# EAGLE design Smart_Mic_V01 (EAGLE 9.2.2)

## Sheet 1 of 2
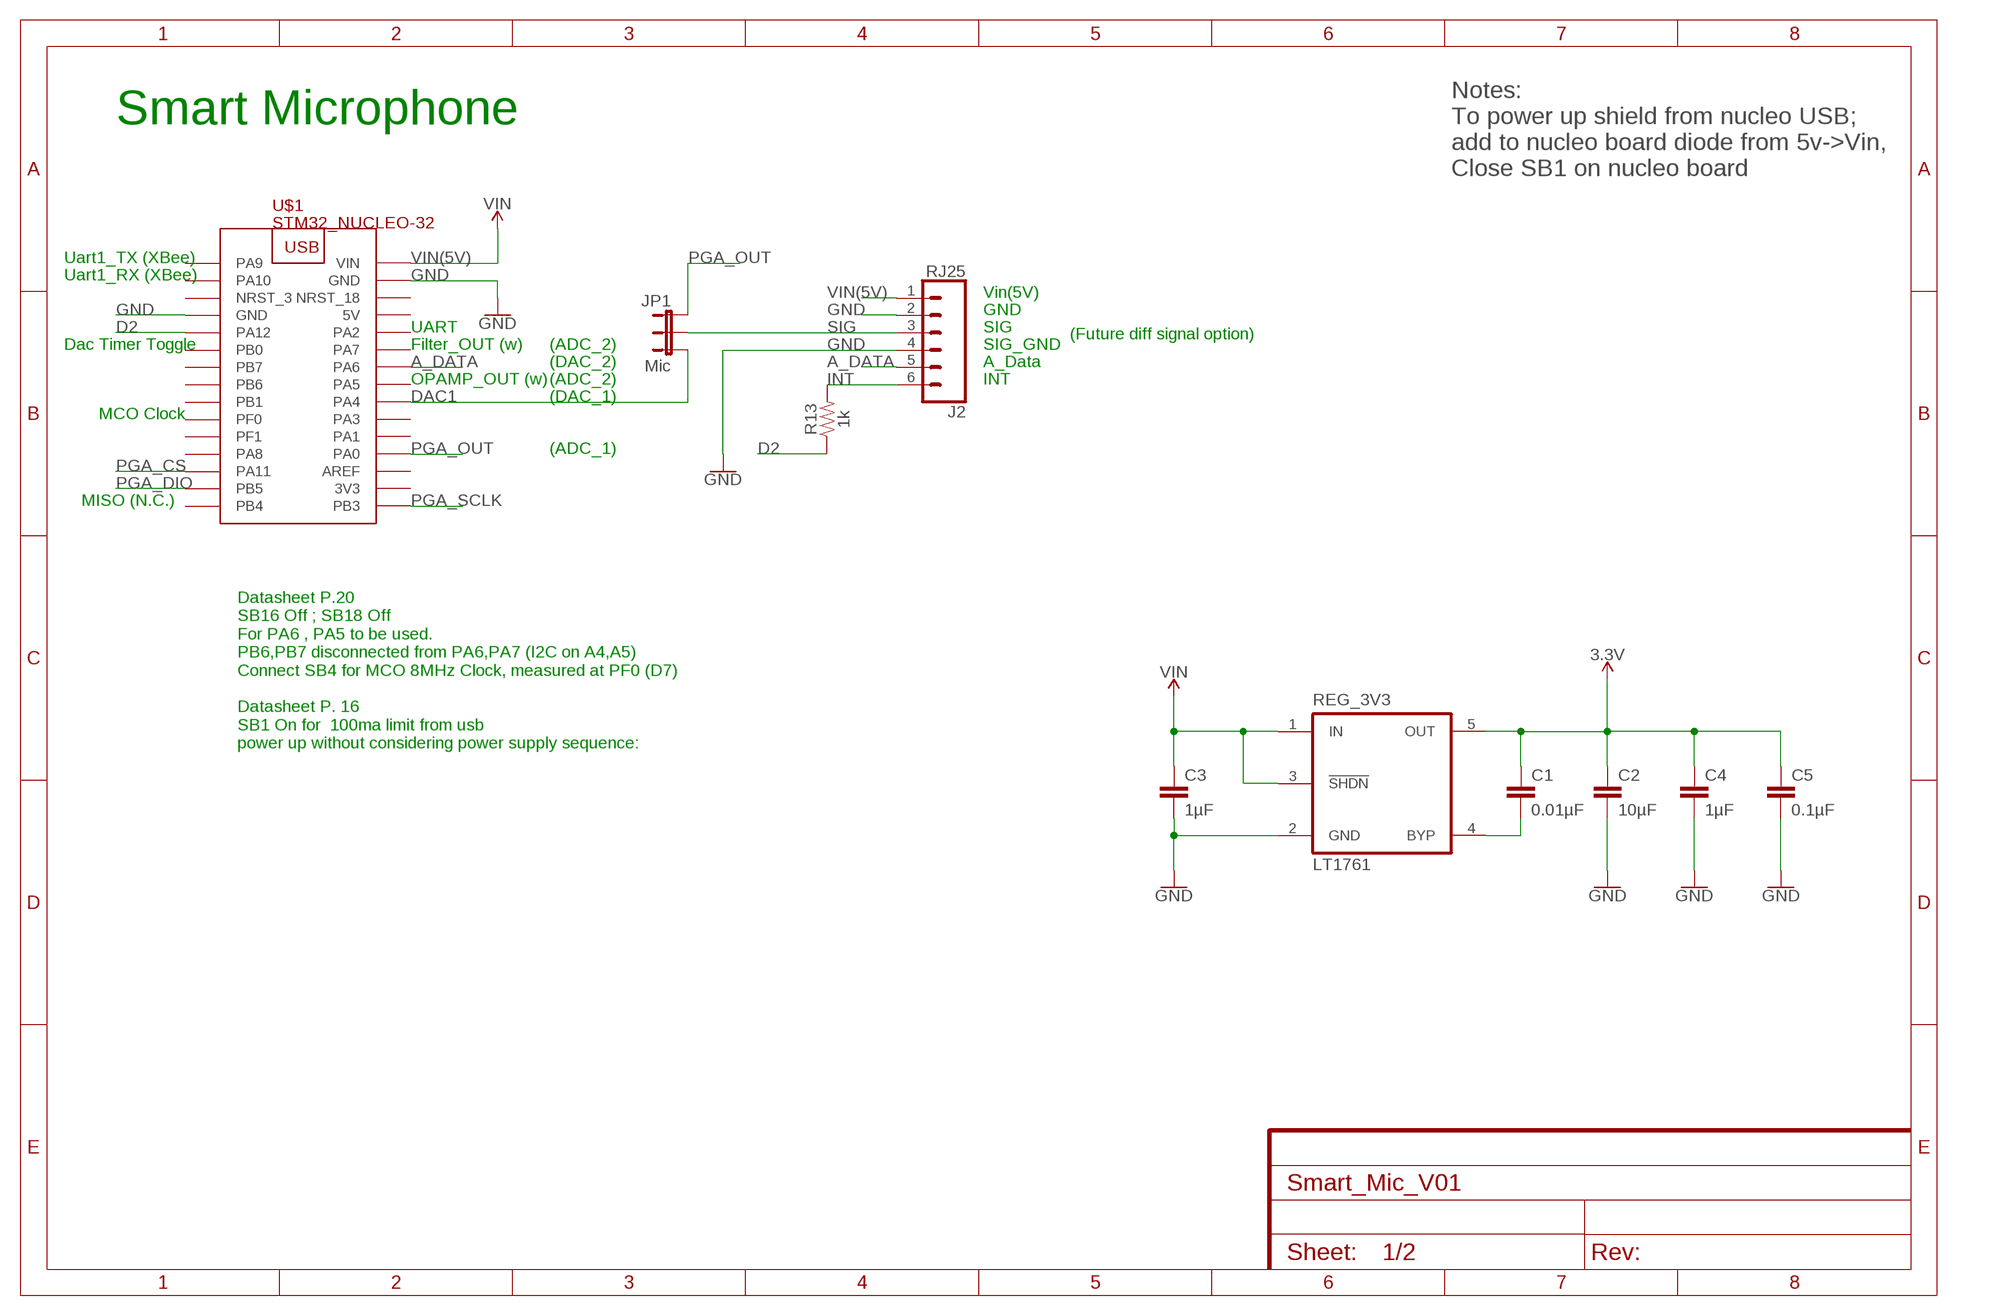
[diagram p0: schematic, sheet 1]

### Parts
C1  0.01µF  0.33UF/330NF-0805-50V-10%  [0805]
C2  10µF  0.33UF/330NF-0805-50V-10%  [0805]
C3  1µF  0.33UF/330NF-0805-50V-10%  [0805]
C4  1µF  0.33UF/330NF-0805-50V-10%  [0805]
C5  0.1µF  0.33UF/330NF-0805-50V-10%  [0805]
J2  RJ25  RJ11-6  [RJ11-6]
JP1  Mic  JUMPER-3PTH  [1X03]
R13  1k  RESISTOR0805  [0805]
REG_3V3  LT1761  [SOT23-5]
U$1  STM32_NUCLEO-32  [STM32_NUCLEO-32]

### Nets
3.3V: C1.1 C2.1 C4.1 C5.1 REG_3V3.5(OUT) ; also sheet 2
A_DATA: J2.5 U$1.PA6
BYP: C1.2 REG_3V3.4(BYP)
D2: R13.1 U$1.PA12
DAC1: JP1.3 U$1.PA4
GND: C2.2 C3.2 C4.2 C5.2 J2.2 J2.4 REG_3V3.2(GND) U$1.GND@4(GND) U$1.GND@17(GND) ; also sheet 2
INT: J2.6 R13.2
PGA_CS: U$1.PA11 ; also sheet 2
PGA_DIO: U$1.PB5 ; also sheet 2
PGA_OUT: JP1.1 U$1.PA0 ; also sheet 2
PGA_SCLK: U$1.PB3 ; also sheet 2
SIG: J2.3 JP1.2
VIN(5V): C3.1 J2.1 REG_3V3.1(IN) REG_3V3.3(!SHDN!) U$1.VIN ; supply symbol labelled VIN
Unconnected: U$1.AREF U$1.NRST_3 U$1.NRST_18 U$1.PA1 U$1.PA2 U$1.PA3 U$1.PA5 U$1.PA7 U$1.PA8 U$1.PA9 U$1.PA10 U$1.PB0 U$1.PB1 U$1.PB4 U$1.PB6 U$1.PB7 U$1.PF0 U$1.PF1

### Notes on the sheet
- Smart Microphone
- Notes:
  To power up shield from nucleo USB; 
  add to nucleo board diode from 5v->Vin,
  Close SB1 on nucleo board
- Uart1_TX (XBee)
- Uart1_RX (XBee)
- Vin(5V)
- GND
- UART | SIG
- (Future diff signal option)
- Dac Timer Toggle | Filter_OUT (w) | (ADC_2) | SIG_GND
- (DAC_2) | A_Data
- OPAMP_OUT (w) | (ADC_2) | INT
- (DAC_1)
- MCO Clock
- (ADC_1)
- MISO (N.C.)
- Datasheet P.20
  SB16 Off ; SB18 Off
  For PA6 , PA5 to be used.
  PB6,PB7 disconnected from PA6,PA7 (I2C on A4,A5)
  Connect SB4 for MCO 8MHz Clock, measured at PF0 (D7)
  
  Datasheet P. 16
  SB1 On for  100ma limit from usb 
  power up without considering power supply sequence:

## Sheet 2 of 2
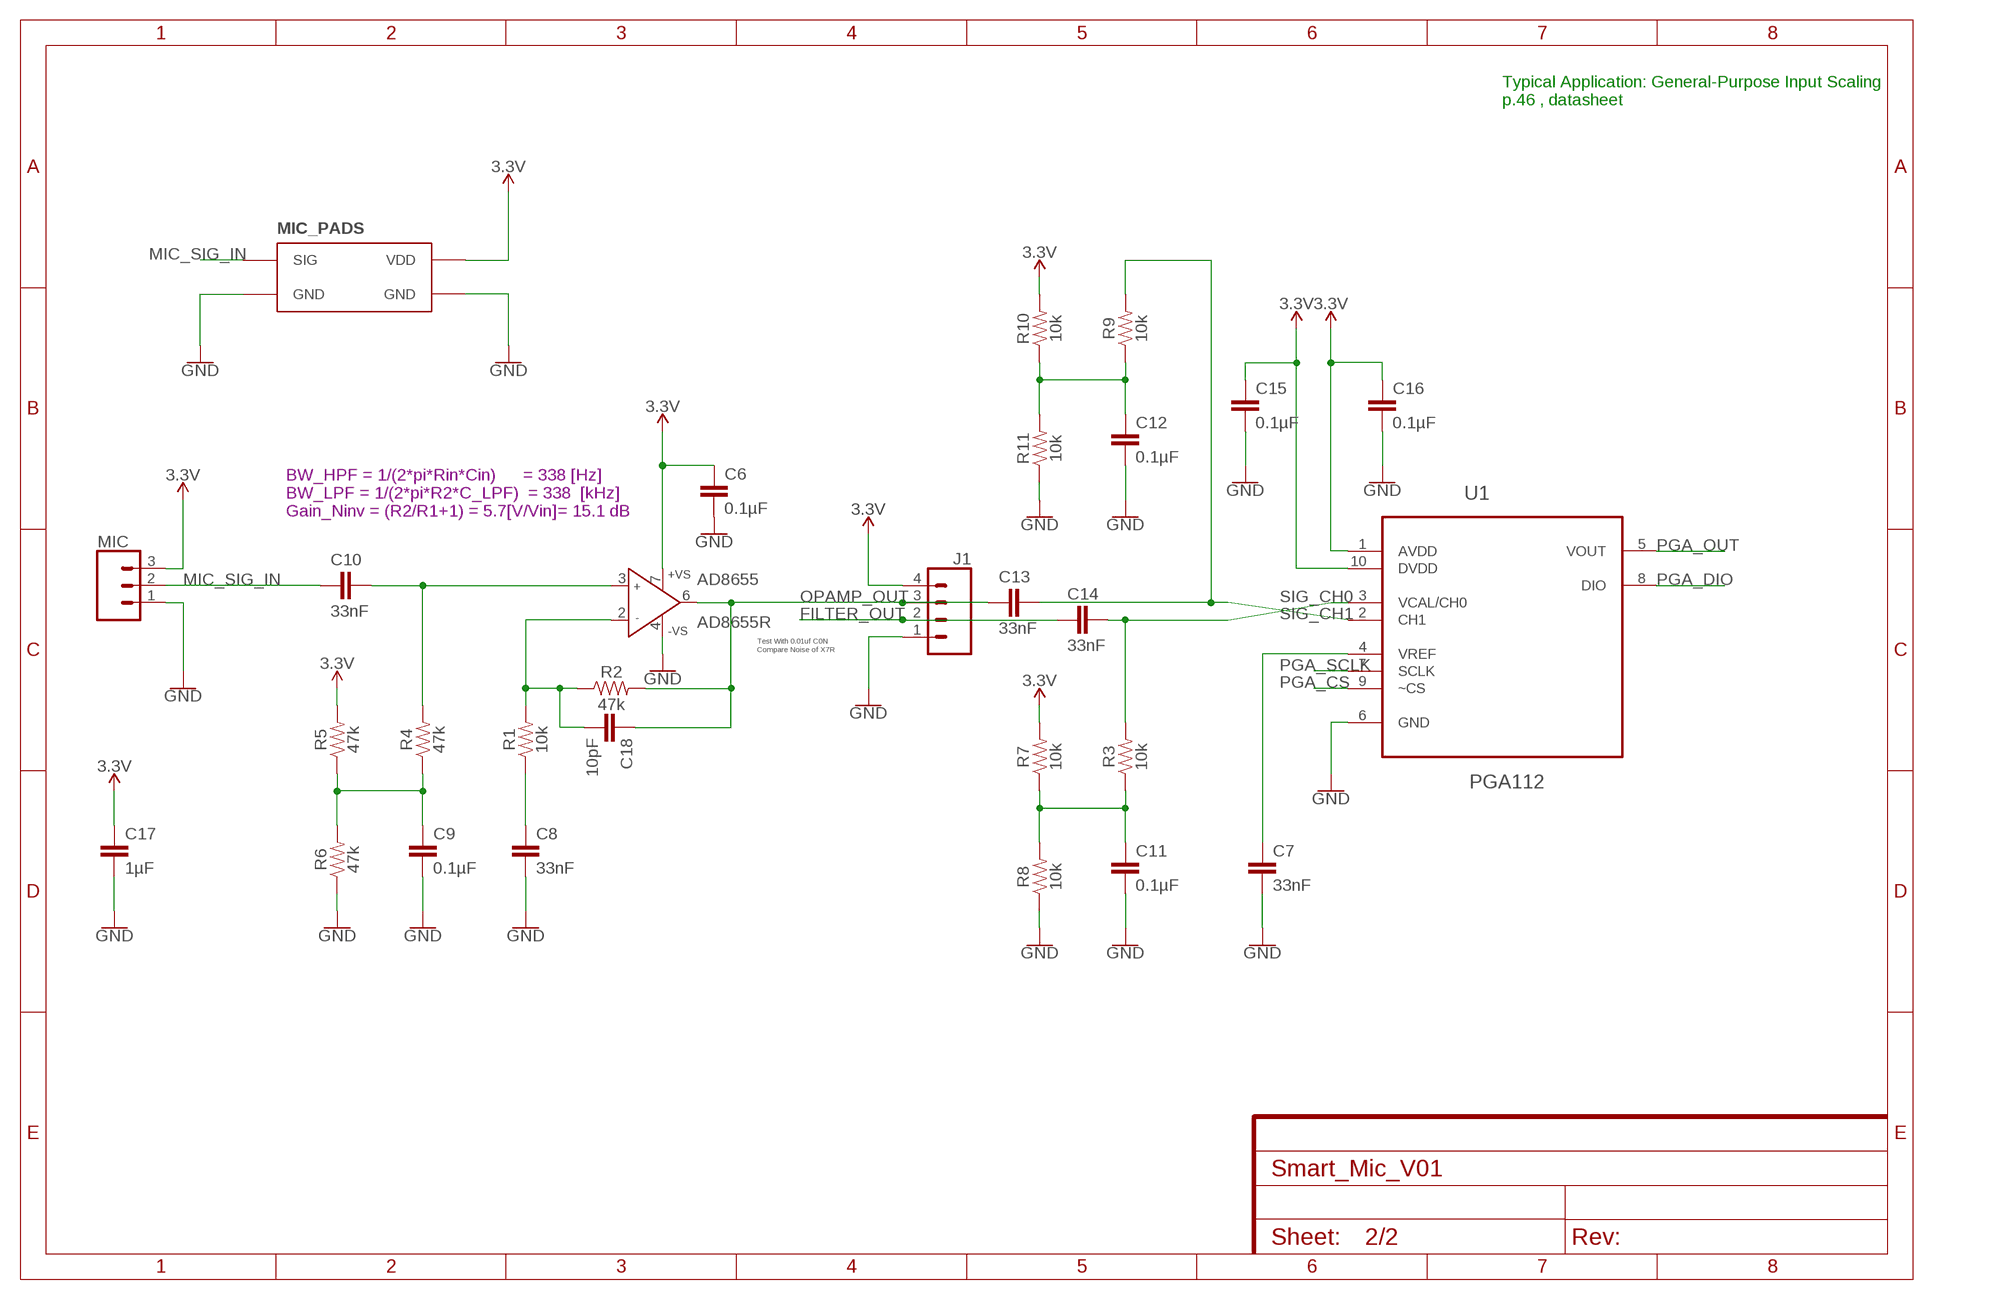
[diagram p1: schematic, sheet 2]

### Parts
AD8655  AD8655R  [SO8]
C6  0.1µF  0.33UF/330NF-0805-50V-10%  [0805]
C7  33nF  0.33UF/330NF-0805-50V-10%  [0805]
C8  33nF  0.33UF/330NF-0805-50V-10%  [0805]
C9  0.1µF  0.33UF/330NF-0805-50V-10%  [0805]
C10  33nF  0.33UF/330NF-0805-50V-10%  [0805]
C11  0.1µF  0.33UF/330NF-0805-50V-10%  [0805]
C12  0.1µF  0.33UF/330NF-0805-50V-10%  [0805]
C13  33nF  0.33UF/330NF-0805-50V-10%  [0805]
C14  33nF  0.33UF/330NF-0805-50V-10%  [0805]
C15  0.1µF  0.33UF/330NF-0805-50V-10%  [0805]
C16  0.1µF  0.33UF/330NF-0805-50V-10%  [0805]
C17  1µF  0.33UF/330NF-0805-50V-10%  [0805]
C18  10pF  0.33UF/330NF-0805-50V-10%  [0805]
J1  CONN_04  [1X04]
MIC  CONN_03  [1X03]
R1  10k  RESISTOR0805  [0805]
R2  47k  RESISTOR0805  [0805]
R3  10k  RESISTOR0805  [0805]
R4  47k  RESISTOR0805  [0805]
R5  47k  RESISTOR0805  [0805]
R6  47k  RESISTOR0805  [0805]
R7  10k  RESISTOR0805  [0805]
R8  10k  RESISTOR0805  [0805]
R9  10k  RESISTOR0805  [0805]
R10  10k  RESISTOR0805  [0805]
R11  10k  RESISTOR0805  [0805]
U1  PGA112  PGA113AIDGST  [SOP50P490X110-10N]
U$2  MIC_PADS  [MIC_PADS]

### Nets
3.3V: AD8655.7(+VS) C6.1 C15.1 C16.1 C17.1 J1.4 MIC.3 R5.2 R7.2 R10.2 U1.1(AVDD) U1.10(DVDD) U$2.VDD ; also sheet 1
FILTER_OUT: C14.2 J1.2
GND: AD8655.4(-VS) C6.2 C7.2 C8.2 C9.2 C11.2 C12.2 C15.2 C16.2 C17.2 J1.1 MIC.1 R6.1 R8.1 R11.1 U1.6(GND) U$2.GND$2(GND) U$2.GND$4(GND) ; also sheet 1
MIC_SIG_IN: C10.2 MIC.2 U$2.SIG
N$1: C7.1 U1.4(VREF)
N$2: C9.1 R4.1 R5.1 R6.2
N$3: C11.1 R3.1 R7.1 R8.2
N$4: C12.1 R9.1 R10.1 R11.2
N$8: C8.1 R1.1
OP1_+: AD8655.3(IN+) C10.1 R4.2
OP1_-: AD8655.2(IN-) C18.2 R1.2 R2.1
OPAMP_OUT: AD8655.6(OUT) C13.2 C18.1 J1.3 R2.2
PGA_CS: U1.9(~CS) ; also sheet 1
PGA_DIO: U1.8(DIO) ; also sheet 1
PGA_OUT: U1.5(VOUT) ; also sheet 1
PGA_SCLK: U1.7(SCLK) ; also sheet 1
SIG_CH0: C13.1 R9.2 U1.2(CH1)
SIG_CH1: C14.1 R3.2 U1.3(VCAL/CH0)

### Notes on the sheet
- Typical Application: General-Purpose Input Scaling 
  p.46 , datasheet
- BW_HPF = 1/(2*pi*Rin*Cin)      = 338 [Hz]
  BW_LPF = 1/(2*pi*R2*C_LPF)  = 338  [kHz]
  Gain_Ninv = (R2/R1+1) = 5.7[V/Vin]= 15.1 dB
- Test With 0.01uf C0N
  Compare Noise of X7R

## Power pins joined to a net without a drawn wire
3V3: U$1.3V3
5V: U$1.5V

## Library data of the parts
AD8655 = analog-devices:AD8655: Low Noise, Precision CMOS Amplifier Source: http://www.analog.com/static/imported-files/data_sheets/AD8655_8656.pdf; MF: ALTERA CORPORATION; MPN: AD8655ARMZ-REEL; OC_FARNELL: 1078267; OC_NEWARK: 59K7050
C1-C18 = SparkFun-Capacitors:0.33UF/330NF: 0.33µF/330nF ceramic capacitors A capacitor is a passive two-terminal electrical component used to store electrical energy temporarily in an electric field.; PROD_ID: CAP-08469; VALUE: 0.33µF
J1 = SparkFun-Connectors:CONN_04: Multi connection point. Often used as Generic Header-pin footprint for 0.1 inch spaced/style header connections On any of the 0.1 inch spaced packages, you can populate with these: Break Away Headers - Straight <https://www.sparkfun.com/products/116> (PRT-00116) Break Away Male Headers - Right Angle <https://www.sparkfun.com/products/553> (PRT-00553) Female Headers <https://www.sparkfun.com/products/115> (PRT-00115) Break Away Headers - Machine Pin <https://www.sparkfun.com/products/117> (PRT-00117) Break Away Female Headers - Swiss Machine Pin <https://www.sparkfun.com/products/743> (PRT-00743) For SCREWTERMINALS and SPRING TERMINALS visit here: Screw Terimnals on SparkFun.com <https://www.sparkfun.com/search/results?term=Screw+Terminals> (5mm/3.5mm/2.54mm spacing) This device is also useful as a general connection point to wire up your design to another part of your project. Our various solder wires solder well into these plated through hole pads. Hook-Up Wire - Assortment (Stranded, 22 AWG) <https://www.sparkfun.com/products/11375> (PRT-11375) Hook-Up Wire - Assortment (Solid Core, 22 AWG) <https://www.sparkfun.com/products/11367> (PRT-11367) View the entire wire category on our website here <https://www.sparkfun.com/categories/141> Special notes: Molex polarized connector foot print use with SKU : PRT-08231 with associated crimp pins and housings. 1MM SMD Version SKU: PRT-10208; PROD_ID: CONN-09696
J2 = SparkFun-Connectors:RJ11-6: RJ11 Jack - 6 pin Commonly found on CAT3 devices and some Microchip programmers. Here is the connector we sell at SparkFun: RJ11 6-Pin Connector <https://www.sparkfun.com/products/132> (PRT-00132) Datasheet <http://www.sparkfun.com/datasheets/Prototyping/Connectors/RJ11-Datasheet.pdf> It is used on this SparkFun product: SparkFun Weather Shield <https://www.sparkfun.com/products/12081> (DEV-12081) Weather Meters <https://www.sparkfun.com/products/8942> (SEN-08942); PROD_ID: CONN-08590; SF_ID: PRT-00132; VALUE: RJ11
JP1 = SparkFun-Retired:JUMPER-3
MIC = SparkFun-Connectors:CONN_03: Multi connection point. Often used as Generic Header-pin footprint for 0.1 inch spaced/style header connections On any of the 0.1 inch spaced packages, you can populate with these: Break Away Headers - Straight <https://www.sparkfun.com/products/116> (PRT-00116) Break Away Male Headers - Right Angle <https://www.sparkfun.com/products/553> (PRT-00553) Female Headers <https://www.sparkfun.com/products/115> (PRT-00115) Break Away Headers - Machine Pin <https://www.sparkfun.com/products/117> (PRT-00117) Break Away Female Headers - Swiss Machine Pin <https://www.sparkfun.com/products/743> (PRT-00743) Stackable Header - 3 Pin (Female, 0.1") <https://www.sparkfun.com/products/13875> (PRT-13875) For SCREWTERMINALS and SPRING TERMINALS visit here: Screw Terimnals on SparkFun.com <https://www.sparkfun.com/search/results?term=Screw+Terminals> (5mm/3.5mm/2.54mm spacing) This device is also useful as a general connection point to wire up your design to another part of your project. Our various solder wires solder well into these plated through hole pads. Hook-Up Wire - Assortment (Stranded, 22 AWG) <https://www.sparkfun.com/products/11375> (PRT-11375) Hook-Up Wire - Assortment (Solid Core, 22 AWG) <https://www.sparkfun.com/products/11367> (PRT-11367) View the entire wire category on our website here <https://www.sparkfun.com/categories/141> Special notes: Molex polarized connector foot print use with SKU : PRT-08232 with associated crimp pins and housings.
R1-R11 R13 = SparkFun-Resistors:RESISTOR: Generic Resistor Package
REG_3V3 = linear-technology:LT1761: Regulator 100mA, Low Noise, LDO Micropower fixed output with shutdown control
U1 = Texas Instruments_By_element14_Batch_1:PGA113AIDGST: PROGRAMMABLE GAIN AMPLIFIER with MUX; MPN: PGA113AIDGST; OC_FARNELL: 1755004; OC_NEWARK: 15N0085; PACKAGE: MSOP-10; SUPPLIER: Texas Instruments
U$1 = Stm32_Nucleo-32:STM32_NUCLEO-32: STM32_NUCLEO-32
U$2 = Mic_Connector:MIC_PADS

## Net classes
0 default: width 0.254 mm, drill 0.3 mm, clearance 0.203 mm

## Board
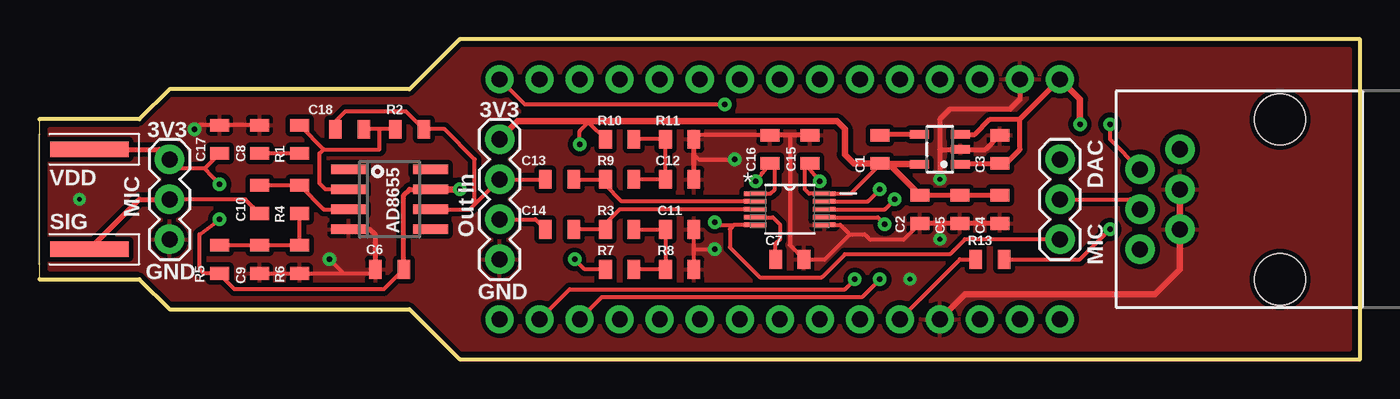
[diagram p2: board, top side]
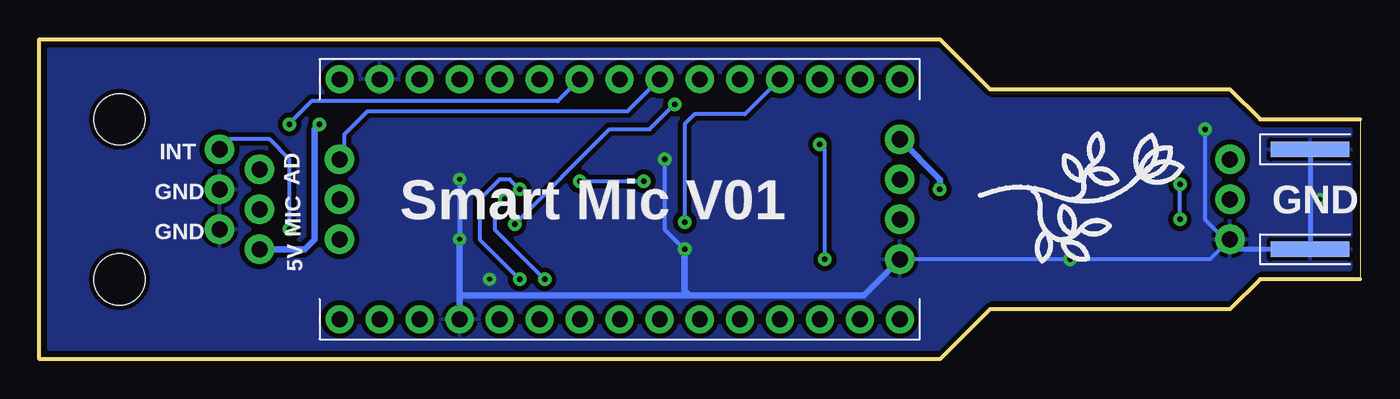
[diagram p3: board, bottom side, seen from below]

Size 83.82 x 20.32 mm. Coordinates in mm from the lower left corner, seen from the top.
Outline: 26.67,0 83.82,0 83.82,20.32 26.67,20.32 23.5,17.14 8.26,17.14 6.35,15.24 0,15.24 0,5.08 6.35,5.08 8.26,3.17 23.5,3.17 26.67,0
Copper layers (1*16): Top 0.035mm / dielectric 1.5mm / Bottom 0.035mm
Design rules "Modified-SparkFun-2-layer-STANDARD *": minimum track width 8mil, minimum drill 0.25mm, track to track 8mil, track to pad 8mil, pad to pad 8mil, via to via 10mil, smd to smd 8mil, copper to edge 8mil, drill to drill 8mil, minimum pad ring 10mil, minimum via ring 10mil, stop-mask expansion 4mil, vias tented up to drill 25mil, thermal gap 10mil

### Footprints (pad centres in the part's own frame; a part is rotated, then mirrored left to right if it is on the bottom)
SO8 = smd 0.6 x 2.2: 1 -1.905,-2.6; 2 -0.635,-2.6; 3 0.635,-2.6; 4 1.905,-2.6; 5 1.905,2.6; 6 0.635,2.6; 7 -0.635,2.6; 8 -1.905,2.6
0805 = smd 0.8 x 1.2: 1 -0.9,0; 2 0.9,0
1X04 = drill 1.016 pad 1.88: 1 0,0; 2 2.54,0; 3 5.08,0; 4 7.62,0
RJ11-6 = drill 1.016 pad 1.88: 1 -3.175,8.89; 2 -1.905,6.35; 3 -0.635,8.89; 4 0.635,6.35; 5 1.905,8.89; 6 3.175,6.35 | hole 3.251: -5.08,0; 5.08,0
1X03 = drill 1.016 pad 1.88: 1 0,0; 2 2.54,0; 3 5.08,0
SOT23-5 = smd 0.55 x 1.2: 1 -0.95,-1.3; 2 0,-1.3; 3 0.95,-1.3; 4 0.95,1.3; 5 -0.95,1.3
SOP50P490X110-10N = smd 1.422 x 0.279: 1 -2.184,0.991; 2 -2.184,0.508; 3 -2.184,0; 4 -2.184,-0.508; 5 -2.184,-0.991; 6 2.184,-0.991; 7 2.184,-0.508; 8 2.184,0; 9 2.184,0.508; 10 2.184,0.991
STM32_NUCLEO-32 = drill 1 pad 1.778: 3V3 16.51,3.81; 5V 16.51,29.21; AREF 16.51,6.35; GND@4 1.27,29.21; GND@17 16.51,34.29; NRST_3 1.27,31.75; NRST_18 16.51,31.75; PA0 16.51,8.89; PA1 16.51,11.43; PA2 16.51,26.67; PA3 16.51,13.97; PA4 16.51,16.51; PA5 16.51,19.05; PA6 16.51,21.59; PA7 16.51,24.13; PA8 1.27,8.89; PA9 1.27,36.83; PA10 1.27,34.29; PA11 1.27,6.35; PA12 1.27,26.67; PB0 1.27,24.13; PB1 1.27,16.51; PB3 16.51,1.27; PB4 1.27,1.27; PB5 1.27,3.81; PB6 1.27,19.05; PB7 1.27,21.59; PF0 1.27,13.97; PF1 1.27,11.43; VIN 16.51,36.83
MIC_PADS = smd 5 x 1 bottom: GND$2 3.175,-3.175; GND$4 3.175,3.175 | smd 5 x 1: SIG 3.175,-3.175; VDD 3.175,3.175

### Placement (x,y rotation side)
AD8655  22.23,10.16 270 top
C1  53.34,13.34 90 top
C2  55.88,9.53 270 top
C3  60.96,13.34 90 top
C4  60.96,9.53 270 top
C5  58.42,9.53 270 top
C6  22.23,5.71 180 top
C7  47.62,6.35 0 top
C8  13.97,13.97 90 top
C9  13.97,6.35 270 top
C10  13.97,10.16 270 top
C11  40.64,8.26 0 top
C12  40.64,11.43 0 top
C13  33.02,11.43 180 top
C14  33.02,8.26 180 top
C15  48.9,13.34 90 top
C16  46.35,13.34 90 top
C17  11.43,13.97 90 top
C18  19.68,14.61 0 top
J1  29.21,6.35 90 top
J2  78.74,10.16 90 top
JP1  64.77,7.62 90 top
MIC  8.26,7.62 90 top
R1  16.51,13.97 90 top
R2  23.5,14.61 0 top
R3  36.83,8.26 180 top
R4  16.51,10.16 90 top
R5  11.43,6.35 270 top
R6  16.51,6.35 90 top
R7  36.83,5.71 180 top
R8  40.64,5.71 180 top
R9  36.83,11.43 180 top
R10  36.83,13.97 180 top
R11  40.64,13.97 180 top
R13  60.33,6.35 0 top
REG_3V3  57.15,13.34 90 top
U1  47.62,9.53 0 top
U$1  27.94,1.27 90 bottom
U$2  0,10.16 0 top

### Tracks (layer width: path | path; a pad name or v marks a point on that pad's centre or on a via)
3.3V  (via drill 0.35)
  Top 0.254: 53.39,12.38 51.52,10.52 U1.10 48.86,10.52 48.58,10.79 48.58,12.44 | C6.1 21.86,4.45 12.38,4.45 11.43,5.4 R5.2 10.43,5.45 10.16,5.71 10.16,7.94 v11.43,8.89 | v11.43,11.11 10.48,12.12 | 10.48,12.12 C17.1 | 10.48,12.12 8.84,12.12 MIC.3 | U1.1 46.39,10.52 46.67,10.79 46.67,12.12 C16.1 45.85,11.8 v45.47,11.3 | R10.2 34.92,14.97 34.92,15.11 34.29,14.48 v34.29,13.65 | R7.2 34.61,5.71 v33.97,6.35 | v49.53,11.3 48.9,12.06 C15.1
  Top 0.305: C2.1 C5.1 C4.1 | C1.1 53.39,12.38 53.92,12.38 | C15.1 48.58,12.44 | C6.1 23.12,10.43 23.5,10.79 AD8655.7 | U$2.VDD 7.62,13.34 MIC.3
  Top 0.406: REG_3V3.5 53.92,12.38 C2.1 | C1.1 51.7,12.44 51.12,13.02 51.12,14.61 50.61,15.11 34.92,15.11 30.35,15.11 J1.4 | v26.67,10.79 AD8655.7
  Bottom 0.254: v11.43,8.89 v11.43,11.11 | v34.29,13.65 33.97,13.34 v33.97,6.35 | v45.47,11.3 v49.53,11.3
  Bottom 0.406: J1.4 26.67,11.43 v26.67,10.79
A_DATA  (via drill 0.35)
  Top 0.254: v67.94,14.92 67.94,13.97 J2.5
  Bottom 0.254: U$1.PA6 50.93,16.38 66.55,16.38 67.94,14.99 v67.94,14.92
BYP
  Top 0.305: REG_3V3.4 53.39,14.29 C1.2
D2
  Top 0.254: U$1.PA12 58.42,6.35 R13.1
DAC1
  Bottom 0.254: JP1.3 64.45,13.02 64.45,14.29 62.99,15.75 46.48,15.75 U$1.PA4
FILTER_OUT
  Top 0.254: J1.2 31.48,8.89 C14.2
GND  (via drill 0.3, 0.35)
  Top 0.254: 55.79,8.53 C2.2 54.88,7.62 52.7,7.62 52.39,7.94 51.44,7.94 | R8.1 41.54,6.99 | 41.54,6.99 C11.2 | C8.2 C17.2 10.11,14.87 v9.84,14.61 | C9.2 R6.1 19.32,5.45 | 19.32,5.45 21.06,5.45 C6.2 | 51.44,7.94 49.85,6.35 C7.2 47.62,7.25 47.62,14.23 | v18.41,6.35 19.32,5.45 | C16.2 41.8,14.23 R11.1 | U1.6 50.84,8.53 51.44,7.94 | 41.54,6.99 v42.86,6.99 | 41.54,13.02 41.86,12.7 v44.13,12.7
  Top 0.305: C3.2 60.06,13.34 REG_3V3.2 57.15,13.34 | C4.2 C5.2 57.15,8.62 | 57.15,8.62 C2.2 | U$1.GND@17 62.23,16.51 61.59,15.88 57.78,15.88 57.15,15.24 57.15,13.34 | 57.15,13.34 v57.15,11.43 | v57.15,7.62 57.15,8.62 | C15.2 47.62,14.23 C16.2 | C12.2 41.54,13.02 R11.1 | C6.2 21.32,7.88 20.95,8.26 AD8655.4
  Top 0.406: J2.4 J2.2 72.39,5.71 70.8,4.13 58.74,4.13 U$1.GND@4
  Bottom 0.254: MIC.1 8.41,7.46 | 8.41,7.46 9.53,6.35 v18.41,6.35 J1.1 | v9.84,14.61 9.84,8.89 8.41,7.46 | v44.13,12.7 44.13,8.26 v42.86,6.99
  Bottom 0.305: v57.15,11.43 v57.15,7.62 | MIC.1 7.62,6.99 U$2.GND$2 U$2.GND$4
  Bottom 0.406: U$1.GND@4 57.15,4.06 | 57.15,4.06 v57.15,7.62 | J1.1 31.5,4.06 42.55,4.06 | 42.55,4.06 57.15,4.06 | 42.55,4.06 42.86,4.38 v42.86,6.99
  other vias: 55.24,5.08 2.54,10.16
  pour Bottom (isolate 0.305): 0.64,5.71 6.35,5.71 8.26,3.81 23.5,3.81 26.67,0.64 83.19,0.64 83.19,19.68 26.67,19.68 23.5,16.51 8.26,16.51 6.35,14.61 0.64,14.61
  pour Top (isolate 0.305): 0.64,5.71 6.35,5.71 8.26,3.81 23.5,3.81 26.67,0.64 83.19,0.64 83.19,19.68 26.67,19.68 23.5,16.51 8.26,16.51 6.35,14.61 0.64,14.61
INT  (via drill 0.35)
  Top 0.254: R13.2 66.04,6.35 v67.94,8.26
  Bottom 0.254: v67.94,8.26 67.94,12.7 69.22,13.97 71.75,13.97 J2.6
MIC_SIG_IN
  Top 0.254: C10.2 13.07,10.16 MIC.2
  Top 0.305: U$2.SIG 6.35,10.16 MIC.2
N$1
  Top 0.254: C7.1 46.73,7.36 46.99,7.62 46.99,8.57 46.55,9.02 U1.4
N$2
  Top 0.254: R5.1 C9.1 R6.2 R4.1
N$3
  Top 0.254: R3.1 C11.1 R8.2 R7.1
N$4
  Top 0.254: R10.1 R11.2 C12.1 R9.1
N$8
  Top 0.254: R1.1 C8.1
OP1_+
  Top 0.254: C10.1 R4.2 18.05,9.53 AD8655.3
OP1_-
  Top 0.254: R2.1 21.59,14.61 | 21.59,14.61 C18.2 | 21.59,14.61 21.59,13.34 18.05,13.34 | R1.2 18.05,13.34 | AD8655.2 18.16,10.79 17.78,11.18 17.78,13.07 18.05,13.34
OPAMP_OUT
  Top 0.254: C13.2 J1.3 27.62,9.84 | AD8655.6 27.3,9.53 27.62,9.84 | 18.79,14.66 C18.1 18.79,15.1 19.43,15.75 23.25,15.75 R2.2 25.72,14.61 27.62,12.7 27.62,9.84
PGA_CS  (via drill 0.35)
  Top 0.254: U1.9 52.58,10.03 v53.34,10.79 | U$1.PA11 35.69,3.94 52.2,3.94 v53.34,5.08
  Bottom 0.254: v53.34,10.79 53.98,11.43 54.61,11.43 55.88,10.16 55.88,7.62 v53.34,5.08
PGA_DIO  (via drill 0.35)
  Top 0.254: U1.8 53.66,9.53 v54.29,10.16 | U$1.PB5 33.66,4.45 51.12,4.45 v51.75,5.08
  Bottom 0.254: v54.29,10.16 54.93,9.53 54.93,8.26 v51.75,5.08
PGA_OUT  (via drill 0.35)
  Top 0.254: JP1.1 58.74,7.62 57.78,6.67 51.12,6.67 49.66,5.21 45.72,5.21 43.81,7.11 43.81,8.26 44.09,8.53 | U1.5 44.09,8.53 | v42.86,8.71 43.04,8.53 44.09,8.53
  Bottom 0.254: U$1.PA0 39.05,15.56 42.23,15.56 42.86,14.92 v42.86,8.71
PGA_SCLK  (via drill 0.35)
  Top 0.254: U1.7 53.21,9.02 v53.66,8.57 | U$1.PB3 30.8,16.19 v43.5,16.19
  Bottom 0.254: v53.66,8.57 47.62,14.61 45.09,14.61 v43.5,16.19
SIG
  Top 0.254: JP1.2 69.22,10.16 J2.3
SIG_CH0
  Top 0.254: U1.2 36.96,10.03 35.93,11.06 R9.2 C13.1
SIG_CH1
  Top 0.254: C14.1 R3.2 35.93,8.62 36.83,9.53 U1.3
VIN(5V)  (via drill 0.35)
  Top 0.305: REG_3V3.1 58.5,12.44 C3.1 61.33,12.44 62.23,13.34 62.23,15.24 | 62.23,15.24 U$1.VIN | REG_3V3.3 59.37,14.29 60.33,15.24 62.23,15.24
  Top 0.406: v66.04,14.92 66.04,16.51 U$1.VIN
  Bottom 0.406: J2.1 66.99,6.99 66.36,7.62 66.36,14.61 v66.04,14.92

### Text on the board
tPlace: 3V3 | 3V3 | DAC | VDD | In | MIC | SIG | Out | GND | GND
bPlace: INT | AD | MIC | GND | GND | Smart Mic V01 | GND | 5V